# Altium schematic sheet Jade_v1_schematics_PG3_PMIC_AXP192.SchDoc
size A4; Author: Hanxiao; Revision: A0_Alpha; SheetNumber: 3; SheetTotal: 4
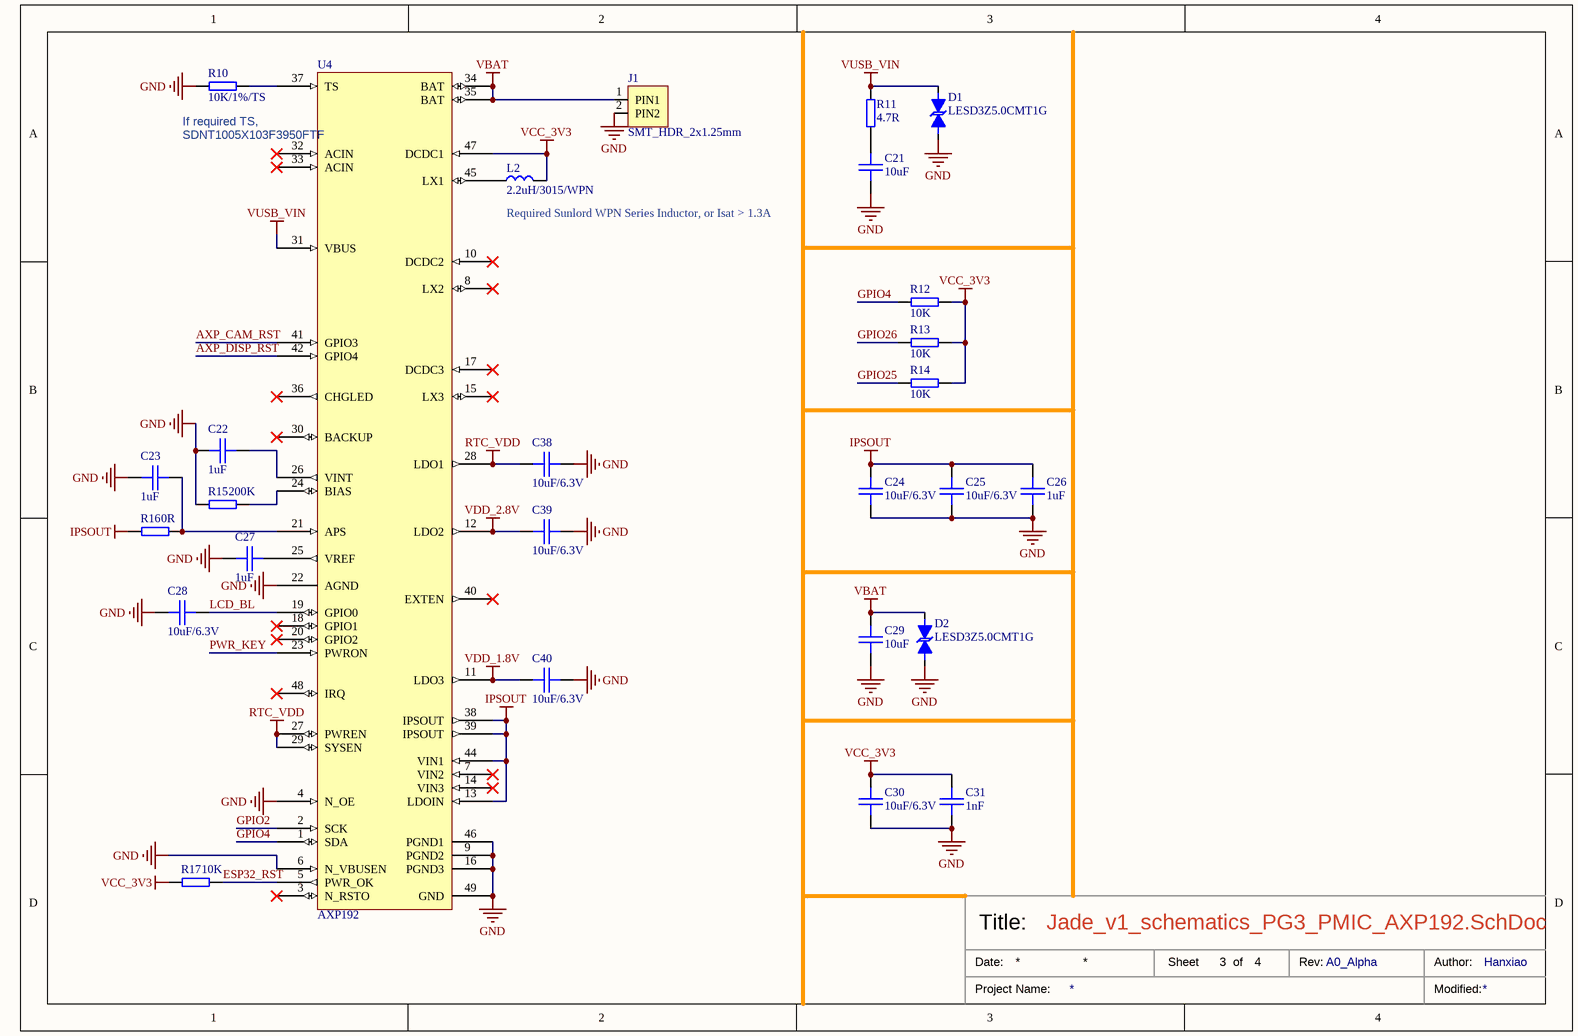
[diagram p0: Jade_v1_schematics_PG3_PMIC_AXP192.SchDoc]

## Parts
C21  10uF  [SMT_C_0402]
C22  1uF  [SMT_C_0402]
C23  1uF  [SMT_C_0402]
C24  10uF/6.3V  [SMT_C_0603]
C25  10uF/6.3V  [SMT_C_0603]
C26  1uF  [SMT_C_0402]
C27  1uF  [SMT_C_0402]
C28  10uF/6.3V  [SMT_C_0603]
C29  10uF  [SMT_C_0402]
C30  10uF/6.3V  [SMT_C_0603]
C31  1nF  [SMT_C_0402]
C38  10uF/6.3V  [SMT_C_0603]
C39  10uF/6.3V  [SMT_C_0603]
C40  10uF/6.3V  [SMT_C_0603]
D1  LESD3Z5.0CMT1G  [SMT_DIODE_SOD_323]
D2  LESD3Z5.0CMT1G  [SMT_DIODE_SOD_323]
J1  SMT_HDR_2x1.25mm  [SMT_HDR_2x1.25mm]
L2  2.2uH/3015/WPN  [SMT_L_3.0mm]
R10  10K/1%/TS  [SMT_R_0402]
R11  4.7R  [SMT_R_0402]
R12  10K  [SMT_R_0402]
R13  10K  [SMT_R_0402]
R14  10K  [SMT_R_0402]
R15  200K  [SMT_R_0402]
R16  0R  [SMT_R_0402]
R17  10K  [SMT_R_0402]
U4  AXP192  [PQFN40P600X600X90_HS-49N]

## Nets
GND: C21.1 C22.1 C23.1 C24.1 C25.1 C26.1 C27.1 C28.1 C29.1 C30.1 C31.1 C38.1 C39.1 C40.1 D1.1(A) D2.1(A) J1.2(PIN2) R10.1 R15.1 U4.4(N_OE) U4.6(N_VBUSEN) U4.9(PGND2) U4.16(PGND3) U4.22(AGND) U4.46(PGND1) U4.49(GND)
IPSOUT: C24.2 C25.2 C26.2 R16.1 U4.13(LDOIN) U4.38(IPSOUT) U4.39(IPSOUT) U4.44(VIN1)
RTC_VDD: C38.2 U4.27(PWREN) U4.28(LDO1) U4.29(SYSEN)
VBAT: C29.2 D2.2(K) J1.1(PIN1) U4.34(BAT) U4.35(BAT)
VCC_3V3: C30.2 C31.2 L2.1 R12.1 R13.1 R14.1 R17.1 U4.47(DCDC1)
VDD_1.8V: C40.2 U4.11(LDO3)
VDD_2.8V: C39.2 U4.12(LDO2)
VUSB_VIN: D1.2(K) R11.2 U4.31(VBUS)
AXP_CAM_RST: U4.41(GPIO3)
AXP_DISP_RST: U4.42(GPIO4)
ESP32_RST: R17.2 U4.5(PWR_OK)
GPIO2: U4.2(SCK)
GPIO4: R12.2 U4.1(SDA)
GPIO25: R14.2
GPIO26: R13.2
LCD_BL: C28.2 U4.19(GPIO0)
PWR_KEY: U4.23(PWRON)
NetC21_2: C21.2 R11.1
NetC22_2: C22.2 U4.26(VINT)
NetC23_2: C23.2 R16.2 U4.21(APS)
NetC27_2: C27.2 U4.25(VREF)
NetL2_2: L2.2 U4.45(LX1)
NetR10_2: R10.2 U4.37(TS)
NetR15_2: R15.2 U4.24(BIAS)

Not connected (* = marked no-connect by the designer): U4 3(N_RSTO)* 7(VIN2)* 8(LX2)* 10(DCDC2)* 14(VIN3)* 15(LX3)* 17(DCDC3)* 18(GPIO1)* 20(GPIO2)* 30(BACKUP)* 32(ACIN)* 33(ACIN)* 36(CHGLED)* 40(EXTEN)* 48(IRQ)*

## Notes on the sheet
- (near U4) If required TS, SDNT1005X103F3950FTF
- (near L2) Required Sunlord WPN Series Inductor, or Isat > 1.3A
- Date:
- Title:
- Sheet
- of
- Rev:
- Author:
- Project Name:
- Modified:

## Library data of the parts
C21-C23 C26 C27 C29 C31 = SMT_C_0402: Surface mount capacitor 0402
C24 C25 C28 C30 C38-C40 = SMT_C_0603: Surface mount capacitor 0603
D1 D2 = SMT_DIODE_TVS_B_SOD_523: Surface mount bidirectional TVS diode SOD-523(0603) Package
J1 = SMT_HDR_2x1.25mm: Surface mount header 2x1.25mm
L2 = SMT_L_3.0mm: SMT Power Inductor, 3.3x3.3x1mm
R10-R17 = SMT_R_0402: Surface mount resistor 0402